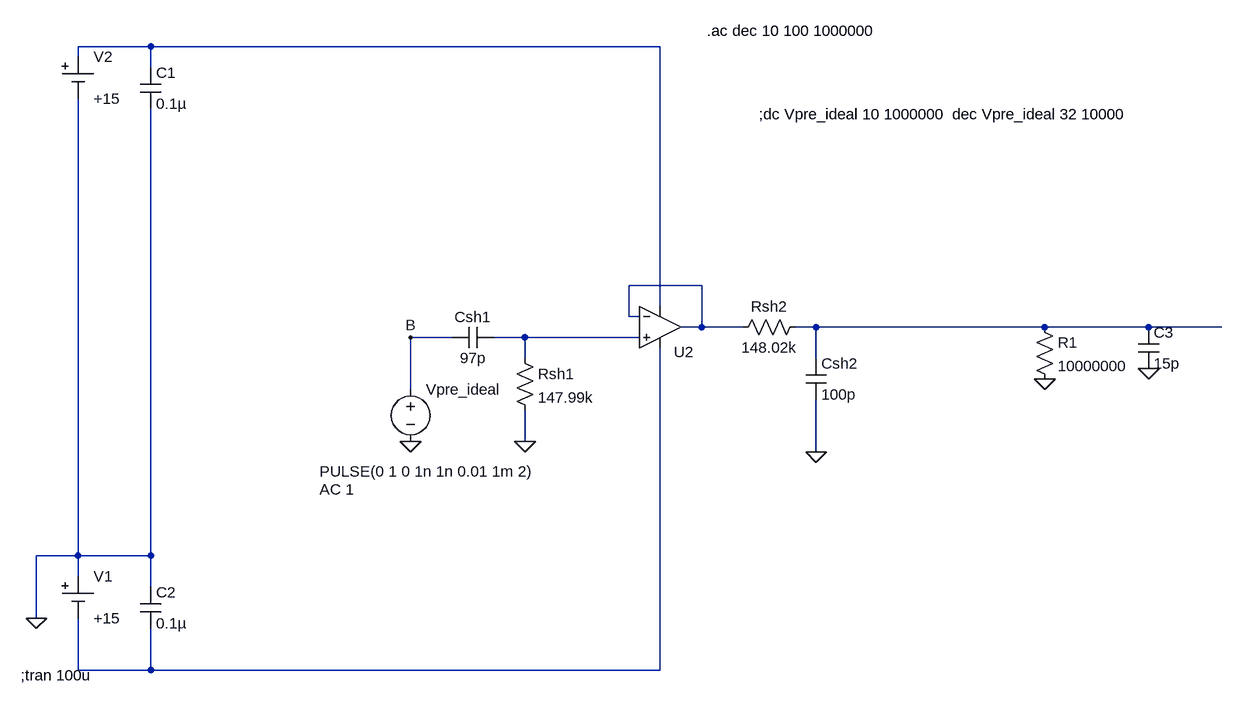
[diagram p0: schematic Circ_2.asc]
Circ_2.asc, the LTspice schematic file:
Version 4
SHEET 1 1400 680
WIRE -432 -624 -544 -624
WIRE 352 -624 -432 -624
WIRE -544 -608 -544 -624
WIRE -432 -592 -432 -624
WIRE 416 -256 304 -256
WIRE 352 -224 352 -624
WIRE 304 -208 304 -256
WIRE 320 -208 304 -208
WIRE 416 -192 416 -256
WIRE 416 -192 384 -192
WIRE 480 -192 416 -192
WIRE 592 -192 560 -192
WIRE 944 -192 592 -192
WIRE 1104 -192 944 -192
WIRE 1216 -192 1104 -192
WIRE 32 -176 -32 -176
WIRE 144 -176 96 -176
WIRE 320 -176 144 -176
WIRE 144 -144 144 -176
WIRE 592 -144 592 -192
WIRE -32 -96 -32 -176
WIRE 144 -16 144 -64
WIRE 592 0 592 -80
WIRE -544 160 -544 -544
WIRE -544 160 -608 160
WIRE -432 160 -432 -528
WIRE -432 160 -544 160
WIRE -544 192 -544 160
WIRE -432 208 -432 160
WIRE -608 256 -608 160
WIRE -544 336 -544 256
WIRE -432 336 -432 272
WIRE -432 336 -544 336
WIRE 352 336 352 -160
WIRE 352 336 -432 336
FLAG -608 256 0
FLAG -32 -16 0
FLAG -32 -176 B
FLAG 144 -16 0
FLAG 592 0 0
FLAG 944 -112 0
FLAG 1104 -128 0
SYMBOL cap -448 208 R0
SYMATTR InstName C2
SYMATTR Value 0.1µ
SYMBOL Misc\\cell -544 192 R0
WINDOW 123 0 0 Left 0
WINDOW 39 0 0 Left 0
SYMATTR InstName V1
SYMATTR Value +15
SYMBOL Misc\\cell -544 -608 R0
WINDOW 123 0 0 Left 0
WINDOW 39 0 0 Left 0
SYMATTR InstName V2
SYMATTR Value +15
SYMBOL cap -448 -592 R0
SYMATTR InstName C1
SYMATTR Value 0.1µ
SYMBOL Opamps/UniversalOpamp2 352 -192 R0
WINDOW 0 21 38 Left 2
SYMATTR InstName U2
SYMBOL voltage -32 -112 R0
WINDOW 3 -140 142 Left 2
WINDOW 123 -140 170 Left 2
WINDOW 39 0 0 Left 0
SYMATTR Value PULSE(0 1 0 1n 1n 0.01 1m 2)
SYMATTR Value2 AC 1
SYMATTR InstName Vpre_ideal
SYMBOL cap 96 -192 R90
WINDOW 0 0 32 VBottom 2
WINDOW 3 32 32 VTop 2
SYMATTR InstName Csh1
SYMATTR Value 97p
SYMBOL res 128 -160 R0
SYMATTR InstName Rsh1
SYMATTR Value 147.99k
SYMBOL res 576 -208 R90
WINDOW 0 0 56 VBottom 2
WINDOW 3 32 56 VTop 2
SYMATTR InstName Rsh2
SYMATTR Value 148.02k
SYMBOL cap 576 -144 R0
SYMATTR InstName Csh2
SYMATTR Value 100p
SYMBOL res 928 -208 R0
SYMATTR InstName R1
SYMATTR Value 10000000
SYMBOL cap 1088 -192 R0
SYMATTR InstName C3
SYMATTR Value 15p
TEXT -632 344 Left 2 !;tran 100u
TEXT 504 -520 Left 2 !;dc Vpre_ideal 10 1000000  dec Vpre_ideal 32 10000
TEXT 424 -648 Left 2 !.ac dec 10 100 1000000

The netlist it stands for:
* Circ_2.asc
C2 0 N005 0.1µ
V1 0 N005 +15
V2 N001 0 +15
C1 N001 0 0.1µ
XU2 N004 N002 N001 N005 N002 level.2 Avol=1Meg GBW=10Meg Slew=10Meg ilimit=25m rail=0 Vos=0 phimargin=45 en=0 enk=0 in=0 ink=0 Rin=500Meg  ; pins IN+ IN- V+ V- OUT
Vpre_ideal B 0 PULSE(0 1 0 1n 1n 0.01 1m 2) AC 1
Csh1 N004 B 97p
Rsh1 N004 0 147.99k
Rsh2 N003 N002 148.02k
Csh2 N003 0 100p
R1 N003 0 10000000
C3 N003 0 15p
;tran 100u
;dc Vpre_ideal 10 1000000  dec Vpre_ideal 32 10000
.ac dec 10 100 1000000
.lib UniversalOpamps2.sub
.backanno
.end